# Altium schematic sheet power-clk.SchDoc: Clock - LDO
size Letter; CheckedBy: J. Brinton; CompanyName: Signal Laboratories, Inc.; DrawnBy: J. Brinton; Engineer: J. Brinton; Address1: 3479 Edison Way; Address2: Menlo Park CA 94025; Address3: +1 (877) 778-8435; Address4: siglabs.com; Revision: 3; SheetNumber: 33; SheetTotal: 49
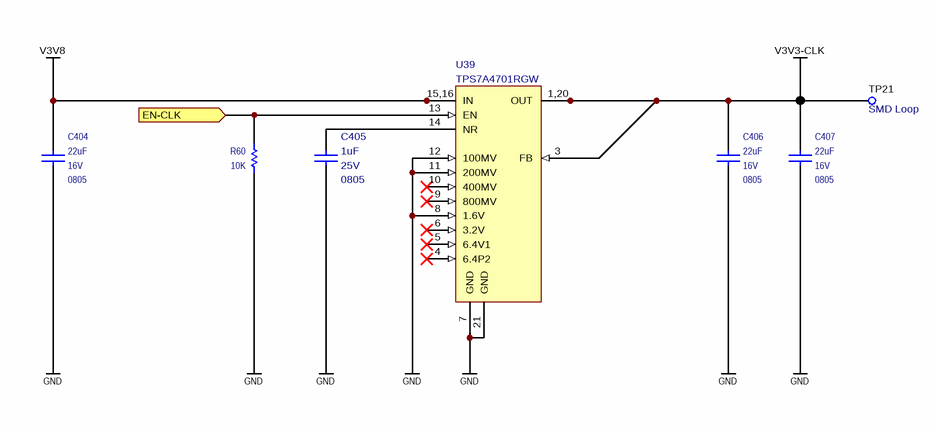
[diagram p0: power-clk.SchDoc]

## Parts
C404  value 22uF  Voltage: 16V  Package: 0805  [CAPC200X125X145L45N]  (hidden comment: CL21A226KOQNNNE)
C405  value 1uF  Package: 0805  Voltage: 25V  [CAPC200X125X145L45N]  (hidden comment: TMK212B7105KG)
C406  value 22uF  Voltage: 16V  Package: 0805  [CAPC200X125X145L45N]  (hidden comment: CL21A226KOQNNNE)
C407  value 22uF  Voltage: 16V  Package: 0805  [CAPC200X125X145L45N]  (hidden comment: CL21A226KOQNNNE)
R60  value 10K  [RESC1005X40N]  (hidden comment: ERJ-2RKF1002X)
TP21  Notes: SMD Loop  [5015]  (hidden comment: 5015)
U39  TPS7A4701RGW  [QFN65P500X500X100-21N]

## Ports
EN-CLK (in)

## Nets
GND: C404.1 C405.2 C406.1 C407.1 R60.2 U39.7(GND) U39.8(1.6V) U39.11(200MV) U39.12(100MV) U39.21(GND)
V3V3-CLK: C406.2 C407.2 TP21.1 U39.1(OUT) U39.3(FB) U39.20(OUT)
V3V8: C404.2 U39.15(IN) U39.16(IN)
EN-CLK: R60.1 U39.13(EN) ; port EN-CLK
NetC405_1: C405.1 U39.14(NR)

Not connected (* = marked no-connect by the designer): U39 4(6.4P2)* 5(6.4V1)* 6(3.2V)* 9(800MV)* 10(400MV)*

## Notes on the sheet
- Title
- Engineer
- Revision
- Drawn By
- Checked By
- Date
- Sheet
- of
- (in symbol TPS7A4701RGW_1) 15,16; 1,20

## Library data of the parts
C404 C406 C407 = CAP 0603: Ceramic Capacitor 22uF ±10% 16V X5R 0805; Manufacturer: Samsung; Tr: -55:85; Manufacturer P/N: CL21A226KOQNNNE; Tolerance: ±10%
C405 = TMK212B7105KG: Ceramic Capacitor 1uF ±10% 25V X7R 0805; Manufacturer: Taiyo Yuden; Manufacturer P/N: TMK212B7105KG; Tolerance: ±10%; Tr: *
R60 = RES 0402: Thick Film Resistor 10k ±1% 0.1W 50V 0402; Manufacturer: Panasonic; Tr: -55:155; Package: 0402; Manufacturer P/N: ERJ-2RKF1002X; Tolerance: ±1%
TP21 = TEST_POINT_SMD_50: Test Point SMD; Manufacturer: Keystone; Manufacturer P/N: 5015
U39 = TPS7A4701RGW_1: Low-Dropout Linear Regulator 20-VQFN; Manufacturer: Texas Instruments; Manufacturer P/N: TPS7A4701RGW; Package: VQFN-20